# EAGLE design breakout (EAGLE 5.11)
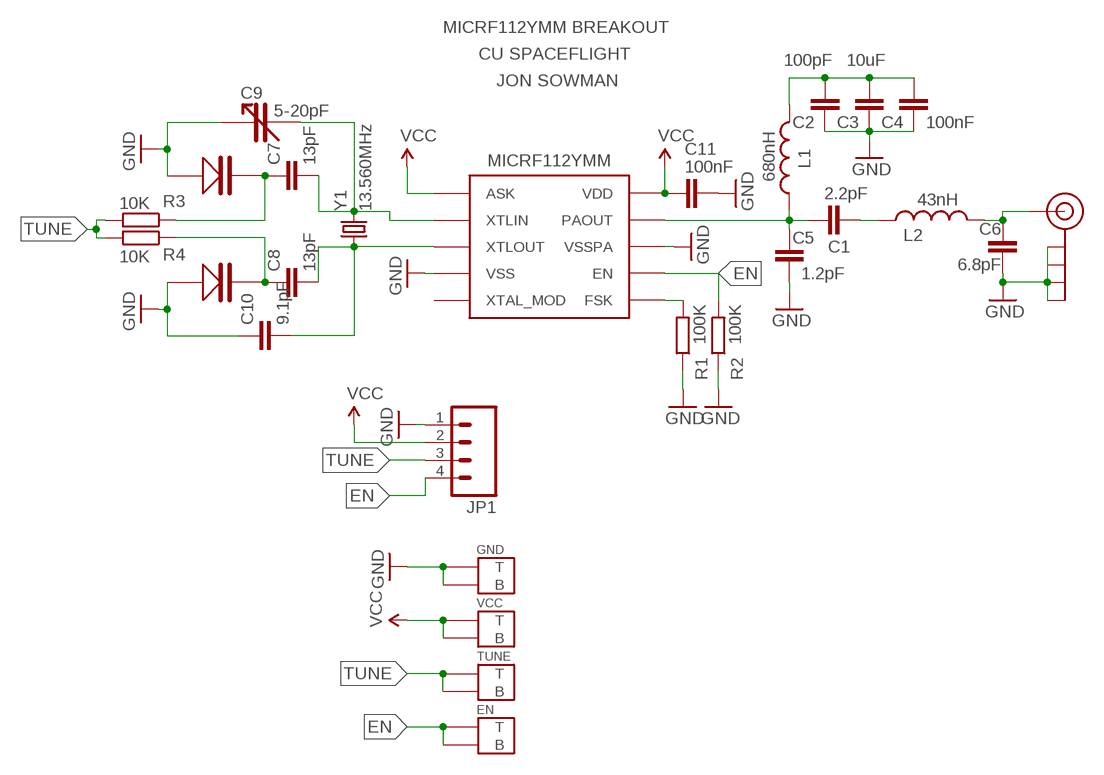
[diagram p0: schematic, sheet 1]

## Parts
C1  2.2pF  C-EUC0603  [C0603]
C2  100pF  C-EUC0603  [C0603]
C3  10uF  C-EUC0603  [C0603]
C4  100nF  C-EUC0603  [C0603]
C5  1.2pF  C-EUC0603  [C0603]
C6  6.8pF  C-EUC0603  [C0603]
C7  13pF  C-EUC0603  [C0603]
C8  13pF  C-EUC0603  [C0603]
C9  5-20pF  VARICAP-CTZ2  [VARICAP-CTZ2]
C10  9.1pF  C-EUC0603  [C0603]
C11  100nF  C-EUC0603  [C0603]
EN  LARGE_PAD  [LARGE_PAD]
GND  LARGE_PAD  [LARGE_PAD]
J$1  SMA_EDGE  [SMA-EDGE]
JP1  M04PTH  [1X04]
L1  680nH  INDUCTOR0603  [0603]
L2  43nH  INDUCTOR0402  [C0402]
R1  100K  R-EU_R0603  [R0603]
R2  100K  R-EU_R0603  [R0603]
R3  10K  R-EU_R0603  [R0603]
R4  10K  R-EU_R0603  [R0603]
TUNE  LARGE_PAD  [LARGE_PAD]
U$1  MICRF112  [MICRF112-MSOP10]
U$2  SMV1247-VARACTOR  [SMV1247-VARACTOR-SC-79]
U$3  SMV1247-VARACTOR  [SMV1247-VARACTOR-SC-79]
VCC  LARGE_PAD  [LARGE_PAD]
Y1  13.560MHz  CRYSTAL5X3  [CRYSTAL-SMD-5X3]

## Nets
EN: EN.P@1(B) EN.P@2(T) JP1.4 R2.2 U$1.EN
GND: C2.1 C3.1 C4.1 C5.1 C6.1 C9.P$1 C10.1 C11.1 GND.P@1(B) GND.P@2(T) J$1.GND@0(GND) J$1.GND@2(GND) J$1.GND@3(GND) JP1.1 R1.1 R2.1 U$1.VSS U$1.VSSPA U$2.AN(ANODE) U$3.AN(ANODE)
N$1: R1.2 U$1.FSK
N$2: C8.2 C10.2 U$1.XTLOUT Y1.1
N$4: C2.2 C3.2 C4.2 L1.2
N$5: C7.2 C9.P$2 U$1.XTLIN Y1.3
N$6: C1.2 L2.1
N$7: C6.2 J$1.SIG(SIGNAL) L2.2
N$8: C7.1 R3.1 U$2.CAT(CATHODE)
N$9: C8.1 R4.1 U$3.CAT(CATHODE)
RFOUT: C1.1 C5.2 L1.1 U$1.PAOUT
TUNE: JP1.3 R3.2 R4.2 TUNE.P@1(B) TUNE.P@2(T)
VCC: C11.2 JP1.2 U$1.ASK U$1.VDD VCC.P@1(B) VCC.P@2(T)
Unconnected: J$1.GND@1(GND) U$1.XTAL_MOD

## Notes on the sheet
- MICRF112YMM BREAKOUT
- CU SPACEFLIGHT
- JON SOWMAN

## Library data of the parts
C1-C8 C10 C11 = rcl:C-EU: CAPACITOR, European symbol
C9 = jonsowman:VARICAP-CTZ2
EN GND TUNE VCC = jonsowman:LARGE_PAD
J$1 = jonsowman:SMA_EDGE: SMA Antenna Connector End launch SMA connector. The paste layer has been removed so that the connector can be hand soldered onto the board after reflow.
JP1 = SparkFun:M04: Header 4 Standard 4-pin 0.1" header. Use with straight break away headers (SKU : PRT-00116), right angle break away headers (PRT-00553), swiss pins (PRT-00743), machine pins (PRT-00117), and female headers (PRT-00115). Molex polarized connector foot print use with SKU : PRT-08231 with associated crimp pins and housings. 1MM SMD Version SKU: PRT-10208
L1 L2 = SparkFun:INDUCTOR: Inductors Basic Inductor/Choke - 0603 and 1206. Footprints are not proven and vary greatly between part numbers.
R1-R4 = rcl:R-EU_: RESISTOR, European symbol
U$1 = jonsowman:MICRF112
U$2 U$3 = jonsowman:SMV1247-VARACTOR
Y1 = SparkFun:CRYSTAL: Crystals Various standard crystals. Proven footprints. Spark Fun Electronics SKU : COM-00534

## Board
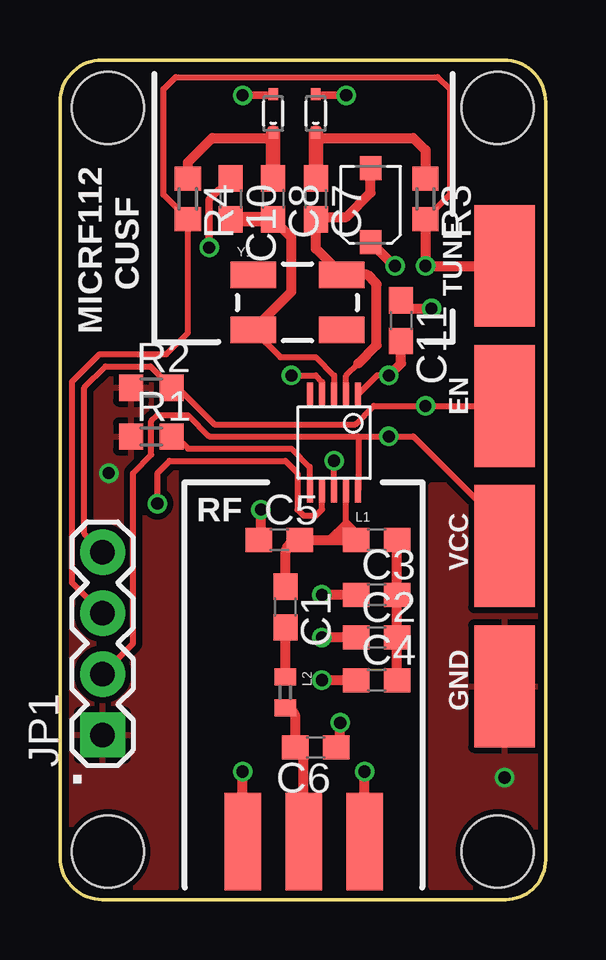
[diagram p1: board, top side]
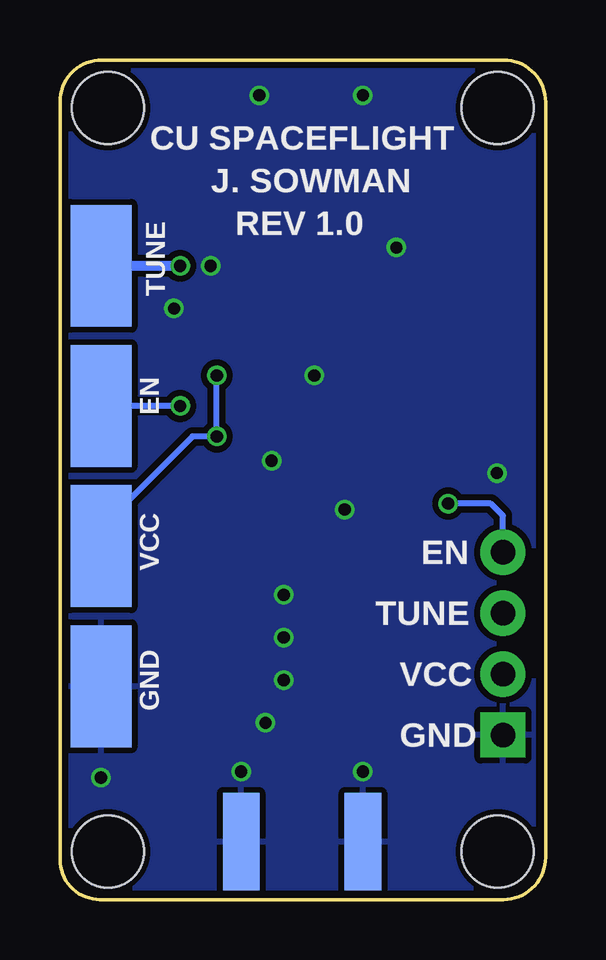
[diagram p2: board, bottom side, seen from below]

Size 20.25 x 35 mm. Coordinates in mm from the lower left corner, seen from the top.
Outline: 20.25,1.67 arc-90 18.59,0 1.76,0 arc-90 0,1.76 0,33.24 arc-90 1.76,35 18.5,35 arc-90 20.25,33.25 20.25,1.67
Copper layers (1*16): Top 0.035mm / dielectric 1.5mm / Bottom 0.035mm
Design rules "jon-fusion": minimum track width 10mil, minimum drill 12mil, track to track 6mil, track to pad 6mil, pad to pad 6mil, via to via 6mil, smd to smd 0mil, copper to edge 10mil, drill to drill 10mil, minimum pad ring 10mil, minimum via ring 6mil, stop-mask expansion 2mil, vias tented up to drill 100mil, thermal gap 10mil
Holes 3 mm at 2,2 2,33 18.25,33 18.25,2

### Footprints (pad centres in the part's own frame; a part is rotated, then mirrored left to right if it is on the bottom)
C0603 = smd 1.1 x 1: 1 -0.85,0; 2 0.85,0
VARICAP-CTZ2 = smd 0.9 x 1: P$1 0,1.54; P$2 0,-1.54
LARGE_PAD = smd 5.08 x 2.54 bottom: P@1 0,0 | smd 5.08 x 2.54: P@2 0,0
SMA-EDGE = smd 1.524 x 4.064: GND@0 0,0; GND@1 5.08,0; SIG 2.54,0 | smd 1.524 x 4.064 bottom: GND@2 0,0; GND@3 5.08,0
1X04 = drill 1.016 pad 1.88 square: 1 0,0 | drill 1.016 pad 1.88 round: 2 2.54,0; 3 5.08,0; 4 7.62,0
0603 = smd 1.1 x 1: 1 -0.85,0; 2 0.85,0
C0402 = smd 0.7 x 0.9: 1 -0.65,0; 2 0.65,0
R0603 = smd 1 x 1.1: 1 -0.85,0; 2 0.85,0
MICRF112-MSOP10 = smd 0.25 x 1: ASK -1,-2; EN 0.5,2; FSK 1,2; PAOUT -0.5,2; VDD -1,2; VSS 0.5,-2; VSSPA 0,2; XTAL_MOD 1,-2; XTLIN -0.5,-2; XTLOUT 0,-2
SMV1247-VARACTOR-SC-79 = smd 0.5 x 0.4: AN 0.8,0; CAT -0.8,0
CRYSTAL-SMD-5X3 = smd 1.9 x 1.1: 1 -1.85,-1.15; 2 1.85,-1.15; 3 1.85,1.15; 4 -1.85,1.15

### Placement (x,y rotation side)
C1  9.4,12.19 270 top
C2  13.21,10.92 0 top
C3  13.21,12.7 0 top
C4  13.21,9.14 0 top
C5  9.14,14.99 0 top
C6  10.67,6.35 180 top
C7  10.67,29.21 270 top
C8  8.89,29.21 270 top
C9  12.95,28.96 180 top
C10  7.11,29.21 270 top
C11  14.22,24.13 270 top
EN  18.54,20.57 90 top
GND  18.54,8.89 90 top
J$1  7.62,2.41 0 top
JP1  1.78,6.86 90 top
L1  13.21,14.99 0 top
L2  9.4,8.64 270 top
R1  3.81,19.3 0 top
R2  3.81,21.34 0 top
R3  15.24,29.21 270 top
R4  5.33,29.21 270 top
TUNE  18.54,26.42 90 top
U$1  11.43,19.05 180 top
U$2  10.67,32.77 90 top
U$3  8.89,32.77 90 top
VCC  18.54,14.73 90 top
Y1  9.91,24.89 0 top

### Tracks (layer width: path | path; a pad name or v marks a point on that pad's centre or on a via)
EN  (via drill 0.51)
  Top 0.254: JP1.4 1.02,15.24 1.02,21.34 1.91,22.23 3.77,22.23 R2.2 4.91,21.34 6.44,19.81 12.32,19.81 13.08,20.57 v15.24,20.57 EN.P@1 | U$1.EN 10.93,16.26 10.67,16 10.16,16 9.91,16.26 9.91,17.78 9.4,18.29 4.57,18.29 4.06,17.78 v4.06,16.51
  Bottom 0.254: JP1.4 1.78,16 2.29,16.51 v4.06,16.51 | v15.24,20.57 EN.P@1
GND  (via drill 0.51)
  Top 0.254: 12.36,12.48 C3.1 | U$1.VSSPA v11.43,18.29 | U$1.VSS 10.93,21.58 10.67,21.84 v9.65,21.84 | U$3.AN 8.85,33.53 | U$2.AN 10.71,33.53 | 13.95,26.42 v13.97,26.42
  Top 0.305: v6.22,27.18 6.22,29.17 C10.1 | 8.85,33.53 v7.62,33.53 | 10.71,33.53 v11.94,33.53
  Top 0.406: C3.1 v10.92,12.7 | J$1.GND@2 v7.62,5.33 | v8.38,16.26 8.38,15.07 C5.1 | 12.7,4.32 v12.7,5.33 | C2.1 v10.92,10.92 | C4.1 v10.92,9.14 | C9.P$1 13.95,26.42 | 13.97,25.23 C11.1 14.57,24.64 v15.49,24.64 | v11.68,7.37 11.68,6.35 11.52,6.18 C6.1
  other vias: 18.54,5.08 2.03,17.78
  pour Bottom (isolate 0.254): 19.81,34.54 19.81,0.51 0.51,0.51 0.51,34.54
  pour Top (isolate 0.254): 0.51,0.51 0.51,22.86 4.83,22.86 4.83,0.51
  pour Top (isolate 0.254): 15.49,17.27 19.81,17.27 19.81,0.51 15.49,0.51
N$1
  Top 0.254: R1.2 4.83,19.3 5.33,18.8 9.65,18.8 10.41,18.03 10.41,17.07 U$1.FSK 10.43,17.03 10.41,17.02
N$2
  Top 0.254: U$1.XTLOUT 11.43,21.84 10.67,22.61 9.19,22.61 Y1.1
  Top 0.406: Y1.1 9.65,25.34 9.65,27.6 C8.2
  Top 0.61: C8.2 C10.2
N$4
  Top 0.406: L1.2 C3.2 C2.2 C4.2
N$5
  Top 0.254: U$1.XTLIN 11.93,21.84 12.45,22.35 | C7.2 10.82,28.36
  Top 0.406: 12.45,22.35 13.21,23.11 13.21,25.65 12.82,26.04 Y1.3 10.67,27.13 C7.2 10.76,28.45 11.94,28.45 12.95,29.46 C9.P$2
N$6
  Top 0.406: L2.1 C1.2
N$7
  Top 0.254: 10.16,6.01 C6.2
  Top 0.406: J$1.SIG 10.16,6.01 | L2.2 arc-90 9.82,7.57 C6.2
N$8
  Top 0.254: U$2.CAT 10.88,31.75
  Top 0.406: R3.1 15.24,31.24 14.73,31.75 10.88,31.75
  Top 0.61: C7.1 U$2.CAT
N$9
  Top 0.254: U$3.CAT 8.85,32 | R4.1 5.25,30.15
  Top 0.406: R4.1 5.33,30.73 6.35,31.75 8.89,31.75
  Top 0.61: C8.1 8.89,31.75 U$3.CAT
RFOUT
  Top 0.254: U$1.PAOUT 11.93,15.41 L1.1 11.68,14.99 | 11.68,14.99 11.94,15.24 | 11.43,14.99 11.94,15.49 | 11.18,14.99 11.94,15.75 12.7,14.99 | 11.68,14.99 11.94,14.73
  Top 0.406: 11.68,14.99 11.43,14.99 11.18,14.99 C5.2 arc90 9.4,14.39 C1.1
TUNE  (via drill 0.51)
  Top 0.254: JP1.3 0.51,13.21 0.51,21.59 1.65,22.73 4.45,22.73 5.33,23.62 R4.2 4.32,29.38 4.32,33.78 4.83,34.29 15.75,34.29 16.26,33.78 16.26,29.38 R3.2 | TUNE.P@2 18.54,27.09
  Top 0.406: R3.2 v15.24,26.42 TUNE.P@2
  Bottom 0.406: v15.24,26.42 TUNE.P@2
VCC  (via drill 0.51)
  Top 0.254: JP1.2 3.05,10.67 3.05,17.78 3.81,18.54 3.81,19.94 4.06,20.19 5.33,20.19 6.22,19.3 12.45,19.3 | 12.45,19.3 v13.72,19.3 14.73,19.3 18.54,15.49 VCC.P@1 18.54,14.99 | U$1.VDD 12.45,17.07 12.45,19.3 | U$1.ASK 13.22,21.84 v13.72,21.84
  Top 0.406: v13.72,21.84 14.22,22.35 C11.2
  Bottom 0.254: v13.72,21.84 v13.72,19.3 14.73,19.3 18.29,15.75 18.29,14.99 18.54,14.99 VCC.P@1

### Text on the board
tPlace: MICRF112 | CUSF | TUNE | EN | RF | VCC | GND | .
bPlace: CU SPACEFLIGHT | J. SOWMAN | REV 1.0 | TUNE | EN | EN | VCC | TUNE | VCC | GND | GND